# EAGLE design SOIC8 to DIL8 (EAGLE 5.02)
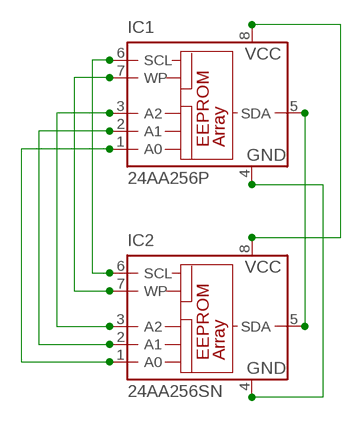
[diagram p0: schematic, sheet 1]

## Parts
IC1  24AA256P  [DIL8]
IC2  24AA256SN  [SO-08]

## Nets
N$1: IC1.6(SCL) IC2.6(SCL)
N$2: IC1.7(WP) IC2.7(WP)
N$3: IC1.3(A2) IC2.3(A2)
N$4: IC1.2(A1) IC2.2(A1)
N$5: IC1.1(A0) IC2.1(A0)
N$6: IC1.5(SDA) IC2.5(SDA)
N$7: IC1.4(GND) IC2.4(GND)
N$8: IC1.8(VCC) IC2.8(VCC)

## Library data of the parts
IC1 IC2 = microchip:24*: Serial EEPROM I2C

## Board
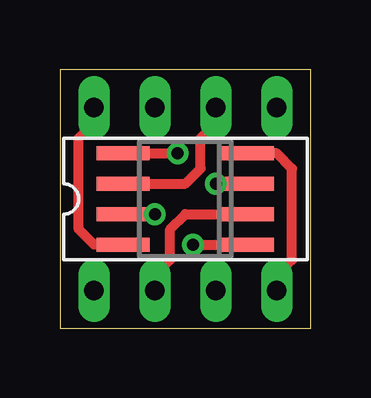
[diagram p1: board, top side]
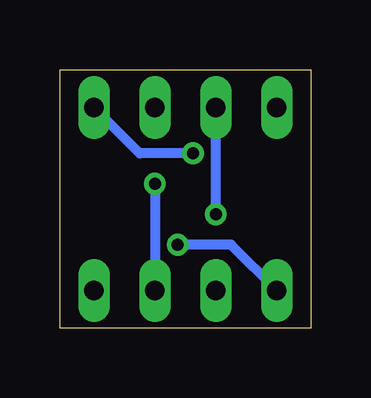
[diagram p2: board, bottom side, seen from below]

Size 10.46 x 10.79 mm. Coordinates in mm from the lower left corner, seen from the top.
Outline: 0,0 10.46,0 10.46,10.79 0,10.79 0,0
Copper layers (1*16): Top 0.035mm / dielectric 1.5mm / Bottom 0.035mm
Design rules "default": minimum track width 10mil, minimum drill 24mil, track to track 8mil, track to pad 8mil, pad to pad 8mil, via to via 8mil, smd to smd 8mil, copper to edge 40mil, drill to drill 8mil, minimum pad ring 10mil, minimum via ring 8mil, stop-mask expansion 4mil, vias tented up to drill 0mil, thermal gap 10mil

### Footprints (pad centres in the part's own frame; a part is rotated, then mirrored left to right if it is on the bottom)
DIL8 = drill 0.813 long: 1 -3.81,-3.81; 2 -1.27,-3.81; 3 1.27,-3.81; 4 3.81,-3.81; 5 3.81,3.81; 6 1.27,3.81; 7 -1.27,3.81; 8 -3.81,3.81
SO-08 = smd 0.6 x 2.2: 1 -1.905,-2.6; 2 -0.635,-2.6; 3 0.635,-2.6; 4 1.905,-2.6; 5 1.905,2.6; 6 0.635,2.6; 7 -0.635,2.6; 8 -1.905,2.6

### Placement (x,y rotation side)
IC1  5.23,5.39 0 top
IC2  5.23,5.39 90 top

### Tracks (layer width: path | path; a pad name or v marks a point on that pad's centre or on a via)
N$1
  Top 0.406: IC2.6 5.23,6.03 5.87,6.66 5.87,7.93 6.5,8.57 IC1.6
N$2  (via drill 0.5)
  Top 0.406: IC2.7 v3.96,4.76
  Bottom 0.406: v3.96,4.76 IC1.7
N$3  (via drill 0.5)
  Top 0.406: IC2.3 v6.5,6.03
  Bottom 0.406: v6.5,6.03 IC1.3
N$4
  Top 0.406: IC2.2 5.23,4.76 4.6,4.12 4.6,2.85 3.96,2.22 IC1.2
N$5  (via drill 0.5)
  Top 0.406: v5.55,3.49 IC2.1
  Bottom 0.406: v5.55,3.49 3.33,3.49 IC1.1
N$6  (via drill 0.5)
  Top 0.406: IC2.5 v4.92,7.3
  Bottom 0.406: v4.92,7.3 7.14,7.3 IC1.5
N$7
  Top 0.406: IC2.4 9.04,7.3 9.68,6.66 9.68,2.85 9.04,2.22 IC1.4
N$8
  Top 0.406: IC2.8 1.42,3.49 0.79,4.12 0.79,7.93 1.42,8.57 IC1.8